# EAGLE design working (EAGLE 6.5.0)
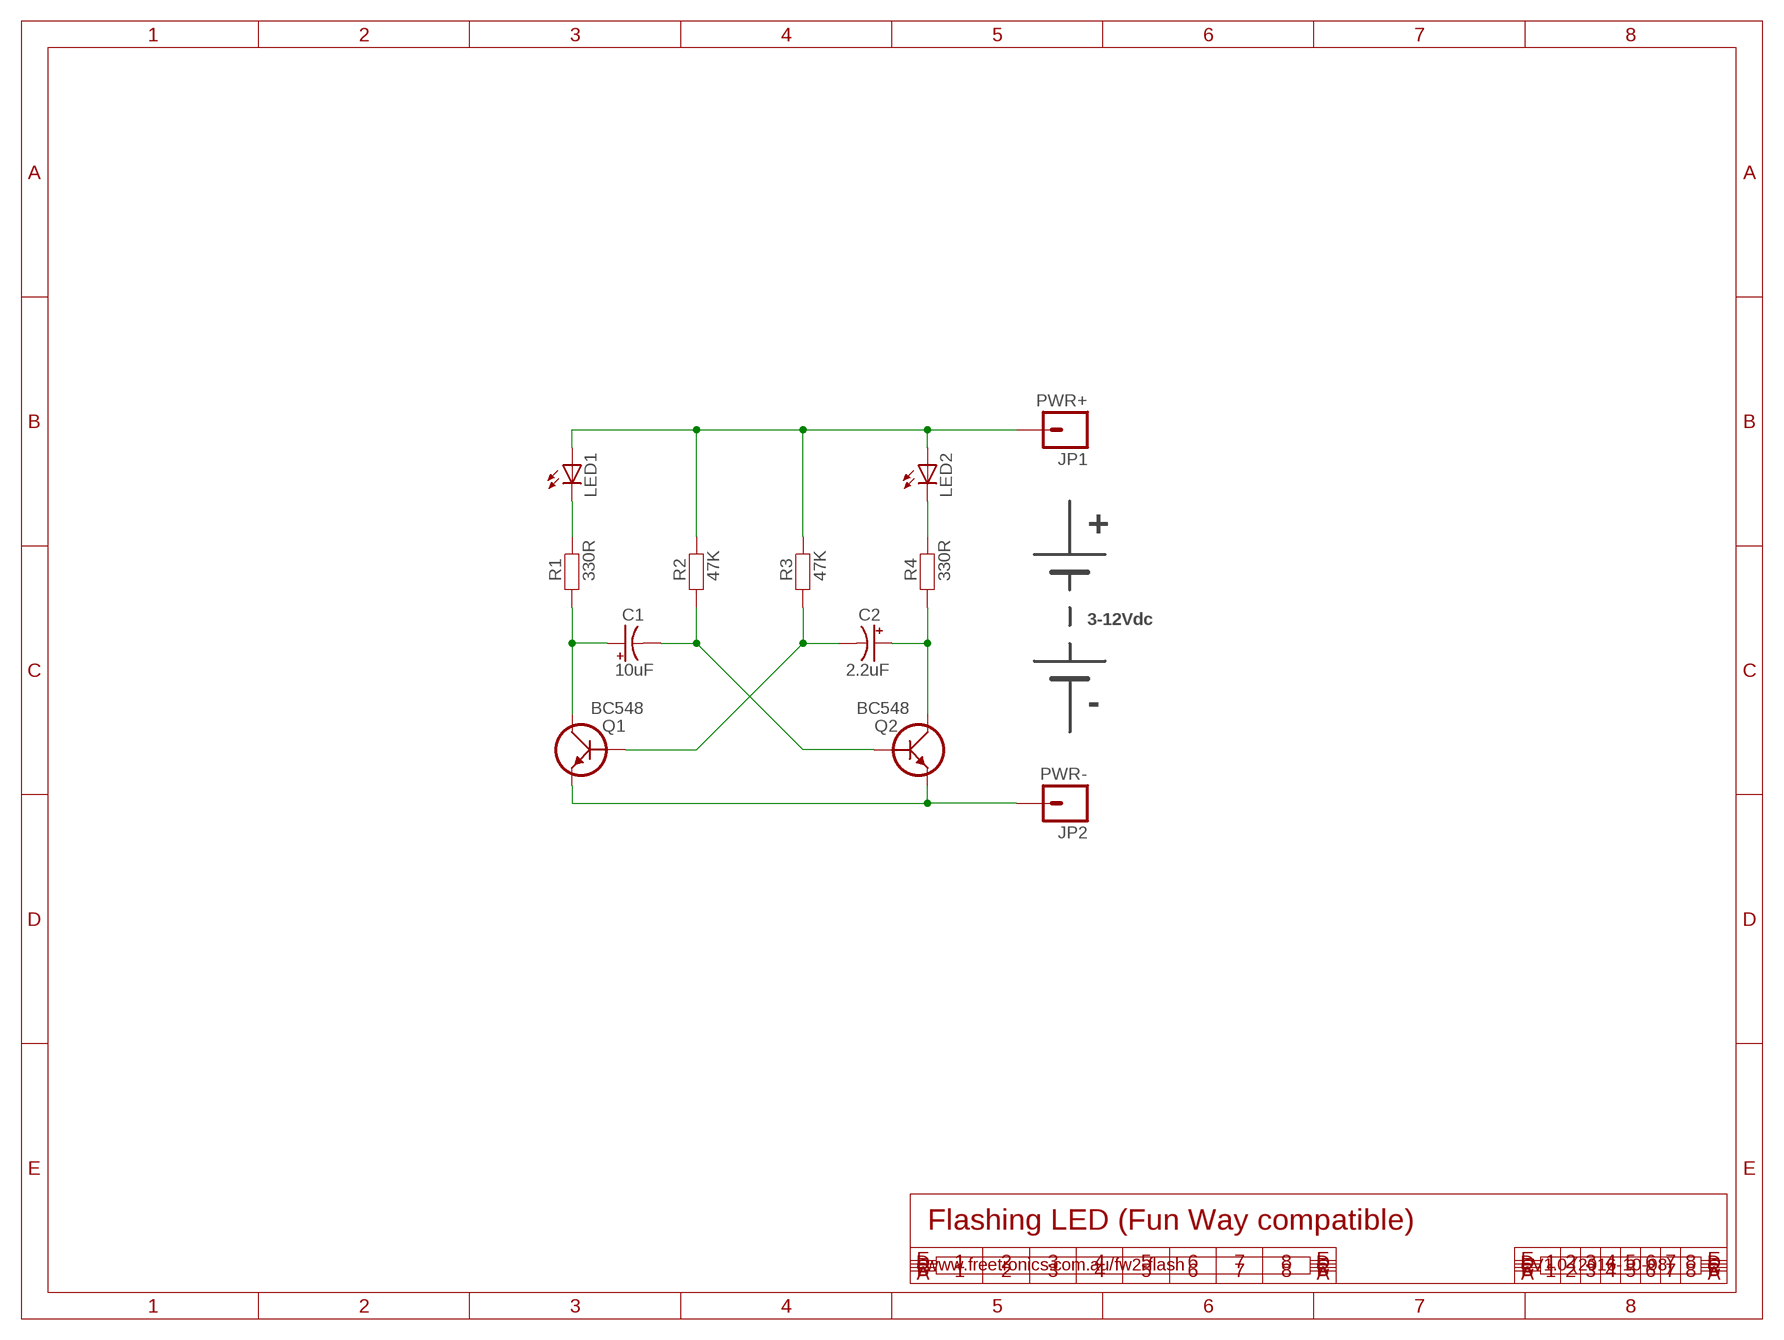
[diagram p0: schematic, sheet 1]

## Parts
C1  10uF  CPOL-USE5-5  [E5-5]
C2  2.2uF  CPOL-USE5-5  [E5-5]
JP1  PWR+  M01PTH  [1X01]
JP2  PWR-  M01PTH  [1X01]
LED1  LED5MML  [LED5MMLARGE]
LED2  LED5MML  [LED5MMLARGE]
Q1  BC548  BC547  [TO-92]
Q2  BC548  BC547  [TO-92]
R1  330R  FREETRONICS_RESISTORPTH3  [AXIAL-0.4-LARGE]
R2  47K  FREETRONICS_RESISTORPTH3  [AXIAL-0.4-LARGE]
R3  47K  FREETRONICS_RESISTORPTH3  [AXIAL-0.4-LARGE]
R4  330R  FREETRONICS_RESISTORPTH3  [AXIAL-0.4-LARGE]

## Nets
N$1: LED1.K(C) R1.P$2
N$2: JP1.1 LED1.A LED2.A R2.P$2 R3.P$2
N$3: C1.+ Q1.1(C) R1.P$1
N$4: C2.+ Q2.1(C) R4.P$1
N$5: LED2.K(C) R4.P$2
N$7: C2.- Q1.2(B) R3.P$1
N$8: C1.- Q2.2(B) R2.P$1
N$9: JP2.1 Q1.3(E) Q2.3(E)

## Notes on the sheet
- +
- 3-12Vdc
- -
- Flashing LED (Fun Way compatible)
- www.freetronics.com.au/fw2-flash | V1.0 (2016-10-08)

## Library data of the parts
C1 C2 = adafruit:CPOL-US: POLARIZED CAPACITOR, American symbol
JP1 JP2 = freetronics-master-v1.1:M01: Header 1 Standard 1-pin 0.1" header. Use with straight break away headers (SKU : PRT-00116), right angle break away headers (PRT-00553), swiss pins (PRT-00743), machine pins (PRT-00117), and female headers (PRT-00115).
LED1 LED2 = freetronics-master-v1.1:LED: LEDs Standard schematic elements and footprints for 5mm, 3mm, 1206, and 0603 sized LEDs. 5mm - Spark Fun Electronics SKU : COM-00529 (and others)
Q1 Q2 = freetronics-master-v1.1:BC547
R1-R4 = freetronics:FREETRONICS_RESISTOR: Resistor Basic schematic elements and footprints for 0603, 1206, and PTH 1/10th watt (small) resistors.

## Board
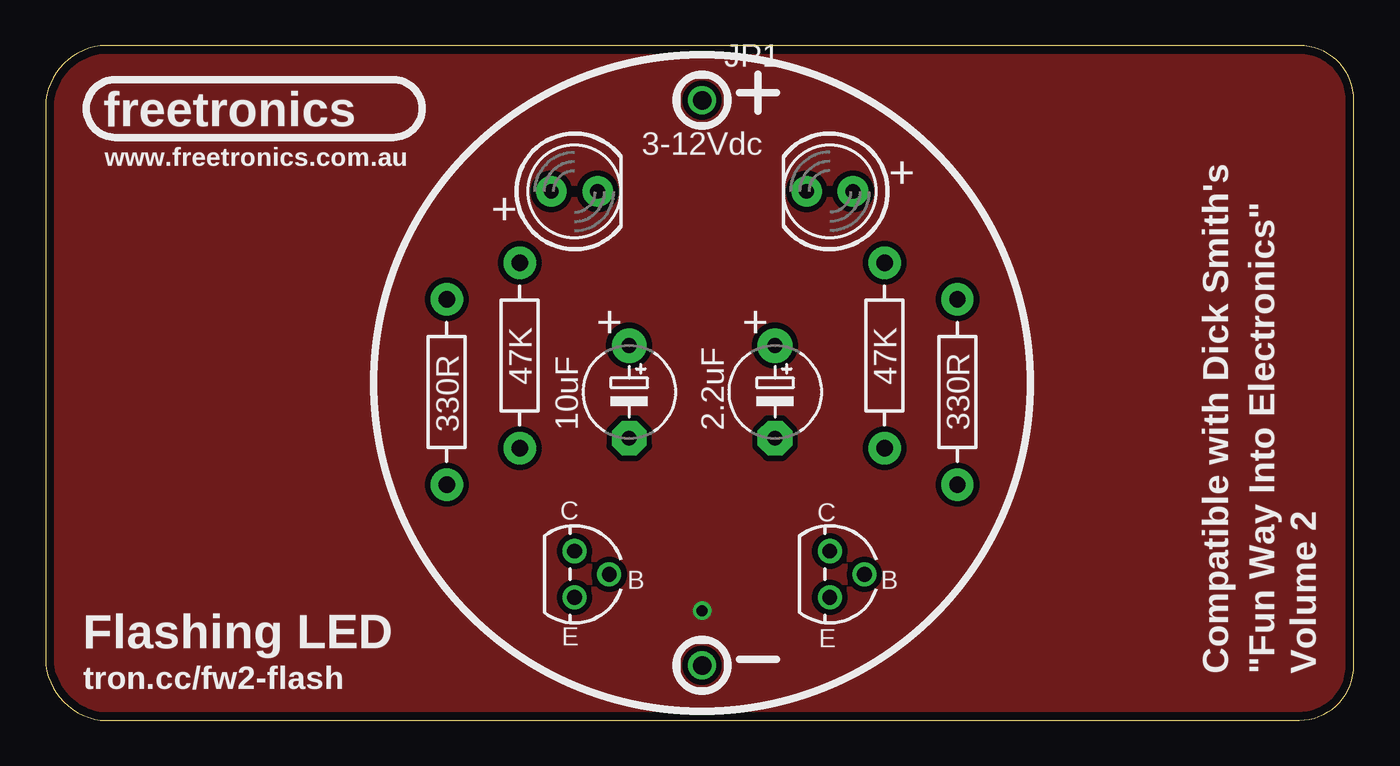
[diagram p1: board, top side]
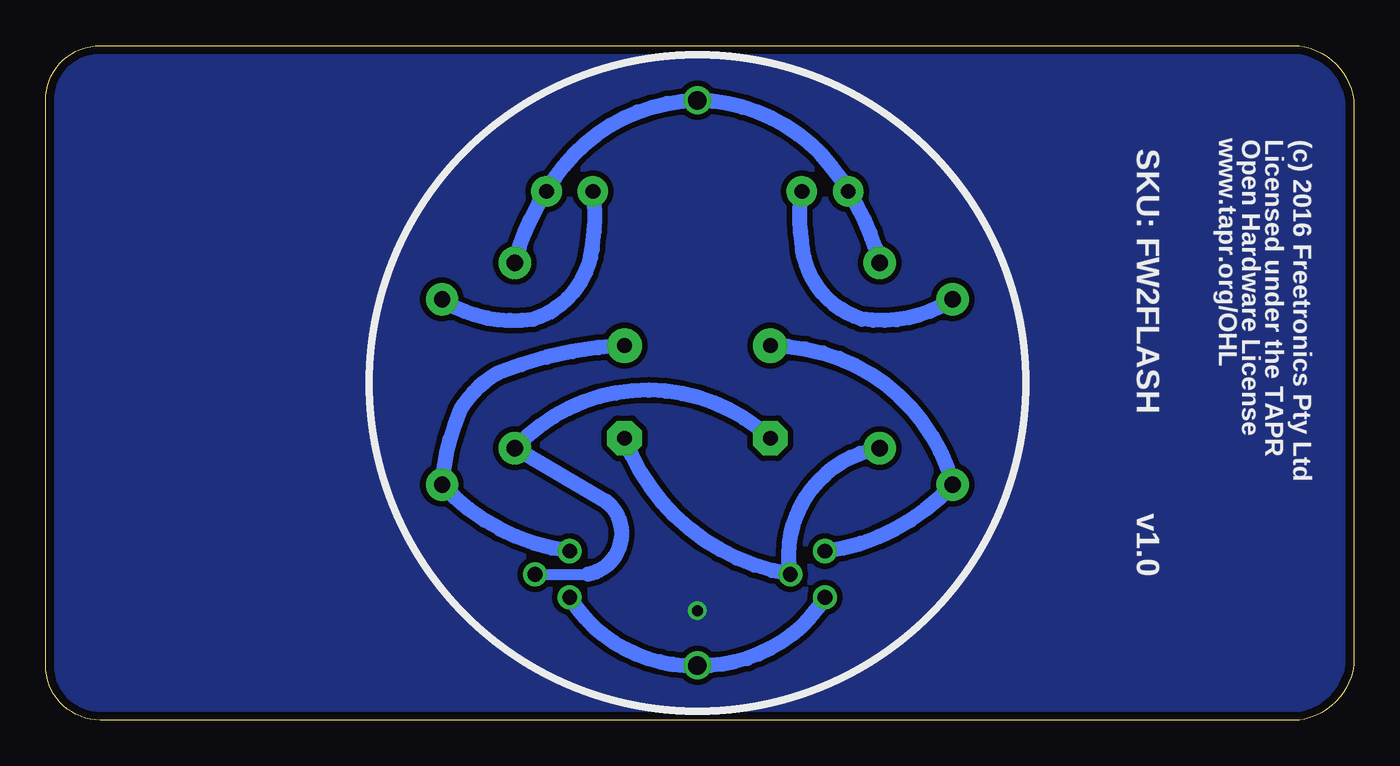
[diagram p2: board, bottom side, seen from below]

Size 71.74 x 37 mm. Coordinates in mm from the lower left corner, seen from the top.
Outline: 0,3 arc74 3,0 68.74,0 arc90 71.74,3 71.74,34 arc90 68.74,37 3,37 arc74 0,34 0,3
Copper layers (1*16): Top 0.035mm / dielectric 1.5mm / Bottom 0.035mm
Design rules "default *": minimum track width 10mil, minimum drill 24mil, track to track 12mil, track to pad 12mil, pad to pad 12mil, via to via 12mil, smd to smd 8mil, copper to edge 18mil, drill to drill 8mil, minimum pad ring 10mil, minimum via ring 8mil, stop-mask expansion 4mil, vias tented up to drill 25mil, thermal gap 10mil

### Footprints (pad centres in the part's own frame; a part is rotated, then mirrored left to right if it is on the bottom)
E5-5 = drill 0.813 pad 1.905: + -2.54,0 | drill 0.813 pad 1.905 octagon: - 2.54,0
1X01 = drill 1.016: 1 0,0
LED5MMLARGE = drill 0.813 pad 1.676: A -1.27,0; K 1.27,0
TO-92 = drill 0.813: 1 -1.27,0; 2 0,1.905; 3 1.27,0
AXIAL-0.4-LARGE = drill 0.9 pad 1.778: P$1 -5.08,0; P$2 5.08,0

### Placement (x,y rotation side)
C1  32,18 270 top
C2  40,18 270 top
JP1  36,34 0 top
JP2  36,3 0 top
LED1  29,29 0 top
LED2  43,29 180 top
Q1  29,8 270 top
Q2  43,8 270 top
R1  22,18 90 top
R2  46,20 90 top
R3  26,20 90 top
R4  50,18 90 top

### Tracks (layer width: path | path; a pad name or v marks a point on that pad's centre or on a via)
GND  (via drill 0.6)
  other vias: 36,6
  pour Bottom: 0,34 arc-74 3,37 68.74,37 arc-74 71.74,34 71.74,3 arc-74 68.74,0 3,0 arc-74 0,3
  pour Top: 0,34 arc-74 3,37 68.74,37 arc-74 71.74,34 71.74,3 arc-74 68.74,0 3,0 arc-74 0,3
N$1
  Bottom 0.813: R1.P$2 22.08,23 arc40 27,22 arc70 30.27,26.27 arc20 LED1.K
N$2
  Bottom 0.813: R3.P$2 arc-20 LED1.A arc-60 JP1.1 arc-60 LED2.A arc-20 R2.P$2
N$3
  Bottom 0.813: Q1.1 arc-40 R1.P$1 arc-75 C1.+
N$4
  Bottom 0.813: Q2.1 arc40 R4.P$1 arc20 49,17 arc30 47,19 arc20 C2.+
N$5
  Bottom 0.813: R4.P$2 49.92,23 arc-40 45,22 arc-70 41.73,26.27 arc-20 LED2.K
N$7
  Bottom 0.813: C2.- arc-60 Q1.2 arc90 R3.P$1
N$8
  Bottom 0.61: Q2.2 42,8
  Bottom 0.813: 42,8 arc-130 41,12 R2.P$1 arc90 C1.-
N$9
  Bottom 0.813: Q1.3 arc60 JP2.1 arc60 Q2.3

### Text on the board
tPlace: freetronics | 3-12Vdc | www.freetronics.com.au | + | + | + | + | 10uF | 2.2uF | C | C | B | B | Flashing LED | E | E | Compatible with Dick Smith's | "Fun Way Into Electronics" | Volume 2 | tron.cc/fw2-flash
bPlace: (c) 2016 Freetronics Pty Ltd | Licensed under the TAPR | Open Hardware License | www.tapr.org/OHL | SKU: FW2FLASH | v1.0